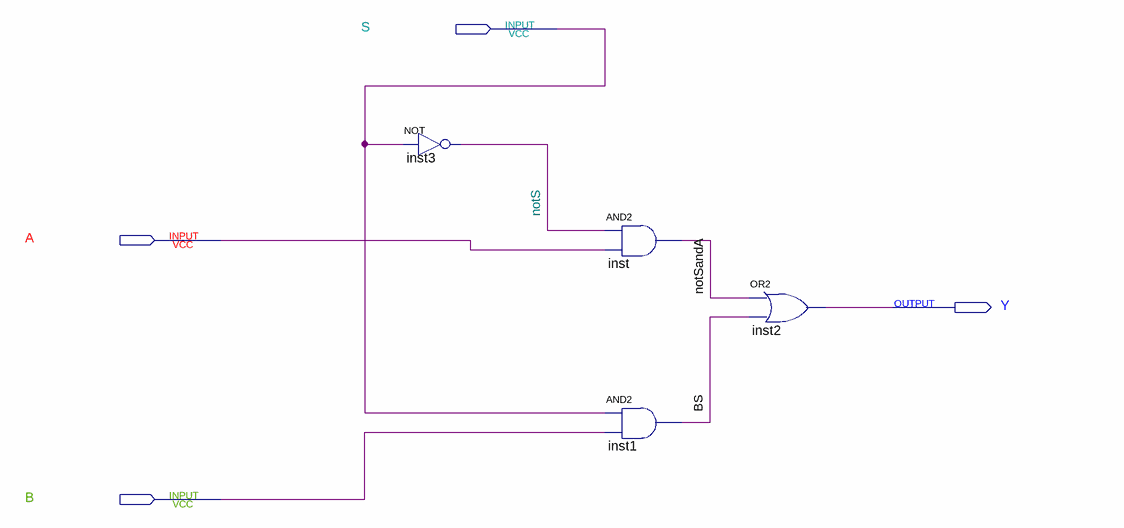
[diagram p0: schematic sheet]
// Quartus schematic MUX2.bdf as structural Verilog: 4 symbols, 4 pins
module MUX2 (
  input  S,
  input  A,
  input  B,
  output Y
);

  wire BS, notS, notSandA;

  not inst3 (notS, S);
  and inst (notSandA, notS, A);
  and inst1 (BS, S, B);
  or inst2 (Y, notSandA, BS);
endmodule
